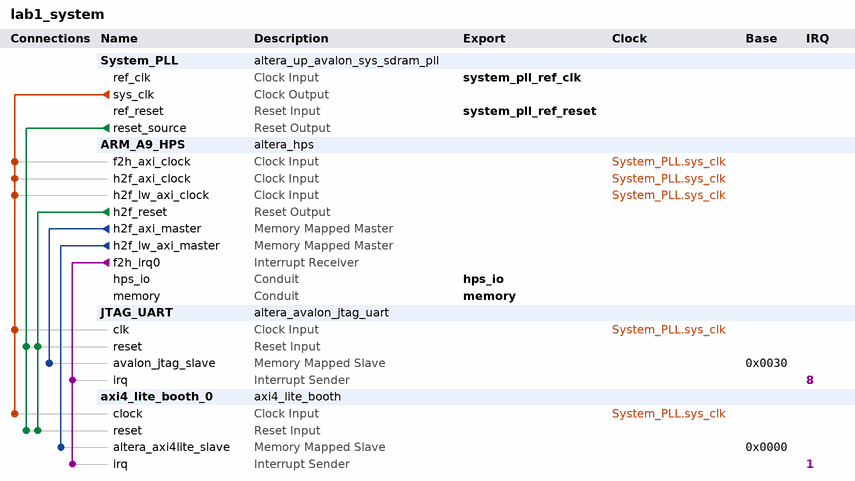
[diagram p0: system contents]
# Platform Designer (Qsys) system lab1_system, Cyclone V 5CSXFC6D6F31C6
# Parameters at their usual value, and those the tool derives, are not listed.
package require -exact qsys 21.1
create_system lab1_system
set_project_property DEVICE_FAMILY {Cyclone V}
set_project_property DEVICE 5CSXFC6D6F31C6

add_instance System_PLL altera_up_avalon_sys_sdram_pll 18.0
set_instance_parameter_value System_PLL CV_boards DE10-Standard
set_instance_parameter_value System_PLL gui_outclk 100.0
set_instance_parameter_value System_PLL gui_refclk 50.0

add_instance ARM_A9_HPS altera_hps 21.1
set_instance_parameter_value ARM_A9_HPS EMAC1_Mode N/A
set_instance_parameter_value ARM_A9_HPS EMAC1_PinMuxing Unused
set_instance_parameter_value ARM_A9_HPS F2SCLK_COLDRST_Enable false
set_instance_parameter_value ARM_A9_HPS F2SCLK_DBGRST_Enable false
set_instance_parameter_value ARM_A9_HPS F2SCLK_WARMRST_Enable false
set_instance_parameter_value ARM_A9_HPS F2SINTERRUPT_Enable true
set_instance_parameter_value ARM_A9_HPS F2S_Width 2
set_instance_parameter_value ARM_A9_HPS FPGA_PERIPHERAL_OUTPUT_CLOCK_FREQ_EMAC0_GTX_CLK 125
set_instance_parameter_value ARM_A9_HPS FPGA_PERIPHERAL_OUTPUT_CLOCK_FREQ_EMAC0_MD_CLK 2.5
set_instance_parameter_value ARM_A9_HPS FPGA_PERIPHERAL_OUTPUT_CLOCK_FREQ_EMAC1_GTX_CLK 125
set_instance_parameter_value ARM_A9_HPS FPGA_PERIPHERAL_OUTPUT_CLOCK_FREQ_EMAC1_MD_CLK 2.5
set_instance_parameter_value ARM_A9_HPS HPS_PROTOCOL DDR3
set_instance_parameter_value ARM_A9_HPS I2C0_Mode N/A
set_instance_parameter_value ARM_A9_HPS I2C0_PinMuxing Unused
set_instance_parameter_value ARM_A9_HPS I2C1_Mode N/A
set_instance_parameter_value ARM_A9_HPS I2C1_PinMuxing Unused
set_instance_parameter_value ARM_A9_HPS LWH2F_Enable true
set_instance_parameter_value ARM_A9_HPS MEM_BANKADDR_WIDTH 3
set_instance_parameter_value ARM_A9_HPS MEM_CLK_FREQ 400.0
set_instance_parameter_value ARM_A9_HPS MEM_COL_ADDR_WIDTH 10
set_instance_parameter_value ARM_A9_HPS MEM_DQ_WIDTH 32
set_instance_parameter_value ARM_A9_HPS MEM_DRV_STR RZQ/6
set_instance_parameter_value ARM_A9_HPS MEM_ROW_ADDR_WIDTH 15
set_instance_parameter_value ARM_A9_HPS MEM_RTT_NOM RZQ/6
set_instance_parameter_value ARM_A9_HPS MEM_RTT_WR {Dynamic ODT off}
set_instance_parameter_value ARM_A9_HPS MEM_TCL 11
set_instance_parameter_value ARM_A9_HPS MEM_TFAW_NS 45.0
set_instance_parameter_value ARM_A9_HPS MEM_TRAS_NS 35.0
set_instance_parameter_value ARM_A9_HPS MEM_TRCD_NS 13.75
set_instance_parameter_value ARM_A9_HPS MEM_TRFC_NS 260.0
set_instance_parameter_value ARM_A9_HPS MEM_TRP_NS 13.75
set_instance_parameter_value ARM_A9_HPS MEM_VENDOR Micron
set_instance_parameter_value ARM_A9_HPS MEM_WTCL 7
set_instance_parameter_value ARM_A9_HPS QSPI_Mode N/A
set_instance_parameter_value ARM_A9_HPS QSPI_PinMuxing Unused
set_instance_parameter_value ARM_A9_HPS REF_CLK_FREQ 25.0
set_instance_parameter_value ARM_A9_HPS S2FCLK_USER2CLK 5
set_instance_parameter_value ARM_A9_HPS S2F_Width 2
set_instance_parameter_value ARM_A9_HPS SDIO_Mode N/A
set_instance_parameter_value ARM_A9_HPS SDIO_PinMuxing Unused
set_instance_parameter_value ARM_A9_HPS SPIM1_Mode N/A
set_instance_parameter_value ARM_A9_HPS SPIM1_PinMuxing Unused
set_instance_parameter_value ARM_A9_HPS STM_Enable true
set_instance_parameter_value ARM_A9_HPS TIMING_BOARD_AC_SKEW 0.02
set_instance_parameter_value ARM_A9_HPS TIMING_BOARD_AC_TO_CK_SKEW 0.01
set_instance_parameter_value ARM_A9_HPS TIMING_BOARD_DQ_TO_DQS_SKEW 0.05
set_instance_parameter_value ARM_A9_HPS TIMING_BOARD_MAX_CK_DELAY 0.03
set_instance_parameter_value ARM_A9_HPS TIMING_BOARD_MAX_DQS_DELAY 0.02
set_instance_parameter_value ARM_A9_HPS TIMING_BOARD_SKEW_BETWEEN_DQS 0.06
set_instance_parameter_value ARM_A9_HPS TIMING_BOARD_SKEW_CKDQS_DIMM_MAX 0.12
set_instance_parameter_value ARM_A9_HPS TIMING_BOARD_SKEW_CKDQS_DIMM_MIN 0.06
set_instance_parameter_value ARM_A9_HPS TIMING_BOARD_SKEW_WITHIN_DQS 0.01
set_instance_parameter_value ARM_A9_HPS TIMING_TDH 65
set_instance_parameter_value ARM_A9_HPS TIMING_TDQSCK 255
set_instance_parameter_value ARM_A9_HPS TIMING_TDQSQ 125
set_instance_parameter_value ARM_A9_HPS TIMING_TDS 30
set_instance_parameter_value ARM_A9_HPS TIMING_TIH 140
set_instance_parameter_value ARM_A9_HPS TIMING_TIS 190
set_instance_parameter_value ARM_A9_HPS TIMING_TQSH 0.4
set_instance_parameter_value ARM_A9_HPS UART0_Mode {No Flow Control}
set_instance_parameter_value ARM_A9_HPS UART0_PinMuxing {HPS I/O Set 0}
set_instance_parameter_value ARM_A9_HPS USB1_Mode SDR
set_instance_parameter_value ARM_A9_HPS USB1_PinMuxing {HPS I/O Set 0}
set_instance_parameter_value ARM_A9_HPS desired_cfg_clk_mhz 100.0
set_instance_parameter_value ARM_A9_HPS desired_qspi_clk_mhz 400.0

add_instance JTAG_UART altera_avalon_jtag_uart 21.1
set_instance_parameter_value JTAG_UART simInteractiveOptions NO_INTERACTIVE_WINDOWS

add_instance axi4_lite_booth_0 axi4_lite_booth 1.0
set_instance_parameter_value axi4_lite_booth_0 C_S_AXI_ADDR_WIDTH 4
set_instance_parameter_value axi4_lite_booth_0 C_S_AXI_DATA_WIDTH 32

# connections
add_connection System_PLL.sys_clk ARM_A9_HPS.f2h_axi_clock clock
add_connection System_PLL.sys_clk ARM_A9_HPS.h2f_axi_clock clock
add_connection System_PLL.sys_clk ARM_A9_HPS.h2f_lw_axi_clock clock
add_connection System_PLL.sys_clk axi4_lite_booth_0.clock clock
add_connection System_PLL.sys_clk JTAG_UART.clk clock
add_connection ARM_A9_HPS.h2f_reset axi4_lite_booth_0.reset reset
add_connection ARM_A9_HPS.h2f_reset JTAG_UART.reset reset
add_connection System_PLL.reset_source axi4_lite_booth_0.reset reset
add_connection System_PLL.reset_source JTAG_UART.reset reset
add_connection ARM_A9_HPS.h2f_axi_master JTAG_UART.avalon_jtag_slave avalon
set_connection_parameter_value ARM_A9_HPS.h2f_axi_master/JTAG_UART.avalon_jtag_slave baseAddress 0x0030
add_connection ARM_A9_HPS.h2f_lw_axi_master axi4_lite_booth_0.altera_axi4lite_slave avalon
set_connection_parameter_value ARM_A9_HPS.h2f_lw_axi_master/axi4_lite_booth_0.altera_axi4lite_slave baseAddress 0x0000
add_connection ARM_A9_HPS.f2h_irq0 axi4_lite_booth_0.irq interrupt
set_connection_parameter_value ARM_A9_HPS.f2h_irq0/axi4_lite_booth_0.irq irqNumber 1
add_connection ARM_A9_HPS.f2h_irq0 JTAG_UART.irq interrupt
set_connection_parameter_value ARM_A9_HPS.f2h_irq0/JTAG_UART.irq irqNumber 8

# exported interfaces
add_interface hps_io conduit end
set_interface_property hps_io EXPORT_OF ARM_A9_HPS.hps_io
add_interface memory conduit end
set_interface_property memory EXPORT_OF ARM_A9_HPS.memory
add_interface system_pll_ref_clk clock sink
set_interface_property system_pll_ref_clk EXPORT_OF System_PLL.ref_clk
add_interface system_pll_ref_reset reset sink
set_interface_property system_pll_ref_reset EXPORT_OF System_PLL.ref_reset

set_interconnect_requirement {$system} qsys_mm.clockCrossingAdapter HANDSHAKE
set_interconnect_requirement {$system} qsys_mm.enableEccProtection FALSE
set_interconnect_requirement {$system} qsys_mm.insertDefaultSlave FALSE
set_interconnect_requirement {$system} qsys_mm.maxAdditionalLatency 1

save_system lab1_system.qsys
